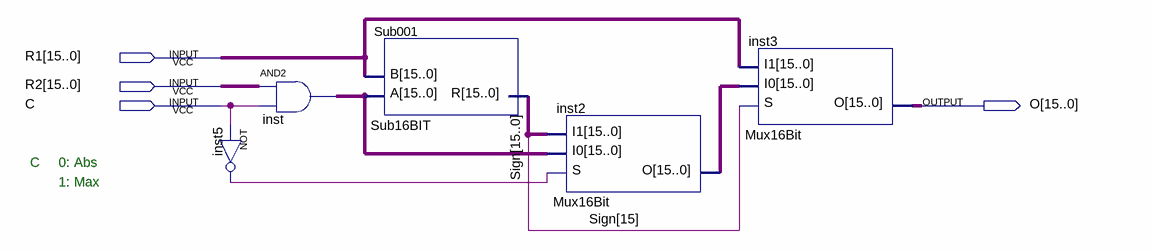
[diagram p0: schematic sheet]
// Quartus schematic AbsMax.bdf as structural Verilog: 5 symbols, 4 pins
module AbsMax (
  input  [15:0] R1,
  input  [15:0] R2,
  input  C,
  output [15:0] O
);

  wire inst5_out;
  wire [15:0] inst2_o, inst_out, Sign;

  not inst5 (inst5_out, C);
  assign inst_out = R2 & {16{C}};  // AND2 inst, 16 bits wide
  Sub16BIT Sub001 (.A(inst_out), .B(R1), .R(Sign));
  Mux16Bit inst2 (.S(inst5_out), .I0(inst_out), .I1(Sign), .O(inst2_o));
  Mux16Bit inst3 (.S(Sign[15]), .I0(inst2_o), .I1(R1), .O(O));

  // Notes on the sheet:
  //   C
  //   0: Abs
  //   1: Max
endmodule
